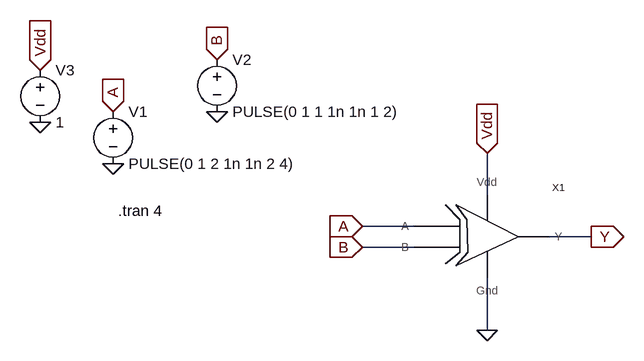
[diagram p0: schematic XOR1_Test.asc]
XOR1_Test.asc, the LTspice schematic file:
Version 4
SHEET 1 880 680
WIRE 256 96 256 32
WIRE 144 144 64 144
WIRE 416 160 352 160
WIRE 144 176 64 176
WIRE 256 304 256 224
FLAG 64 144 A
IOPIN 64 144 In
FLAG 64 176 B
IOPIN 64 176 In
FLAG 256 32 Vdd
IOPIN 256 32 In
FLAG 256 304 0
FLAG 416 160 Y
IOPIN 416 160 Out
FLAG -320 -32 A
IOPIN -320 -32 In
FLAG -160 -112 B
IOPIN -160 -112 In
FLAG -432 -96 Vdd
IOPIN -432 -96 In
FLAG -432 -16 0
FLAG -320 48 0
FLAG -160 -32 0
SYMBOL XOR1 224 144 R0
SYMATTR InstName X1
SYMBOL voltage -320 -48 R0
WINDOW 123 0 0 Left 0
WINDOW 39 0 0 Left 0
SYMATTR InstName V1
SYMATTR Value PULSE(0 1 2 1n 1n 2 4)
SYMBOL voltage -160 -128 R0
WINDOW 123 0 0 Left 0
WINDOW 39 0 0 Left 0
SYMATTR InstName V2
SYMATTR Value PULSE(0 1 1 1n 1n 1 2)
SYMBOL voltage -432 -112 R0
SYMATTR InstName V3
SYMATTR Value 1
TEXT -312 120 Left 2 !.tran 4

The netlist it stands for:
* XOR1_Test.asc
XX1 Vdd 0 A B Y XOR1  ; pins Vdd Gnd A B Y
V1 A 0 PULSE(0 1 2 1n 1n 2 4)
V2 B 0 PULSE(0 1 1 1n 1n 1 2)
V3 Vdd 0 1
.tran 4
.backanno
.end

* Results of the author's LTspice run, read from the files saved beside the schematic
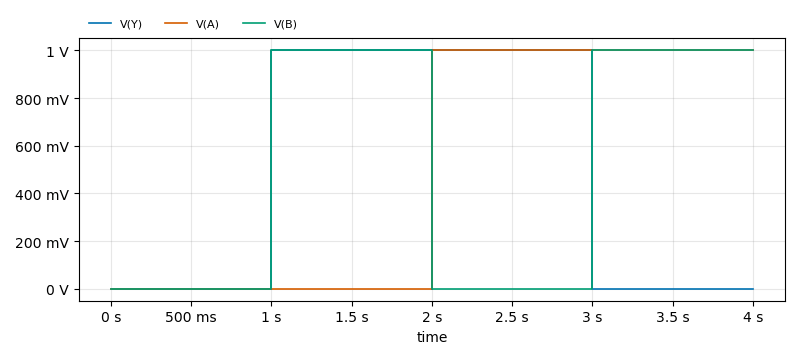
[diagram p1: Transient Analysis of XOR1_Test.asc, plotted from the saved traces]
* Transient Analysis, 1 run:
*   V(Y): min 100.5 nV, max 1 V, average 500 mV, rms 707.1 mV, last 100.5 nV
*   V(A): min 0 V, max 1 V, average 500 mV, rms 707.1 mV, last 1 V
*   V(B): min 0 V, max 1 V, average 500 mV, rms 707.1 mV, last 1 V